# Altium schematic sheet Sheet1.SchDoc
size 420 x 297 mm; SheetNumber: 1; SheetTotal: 1
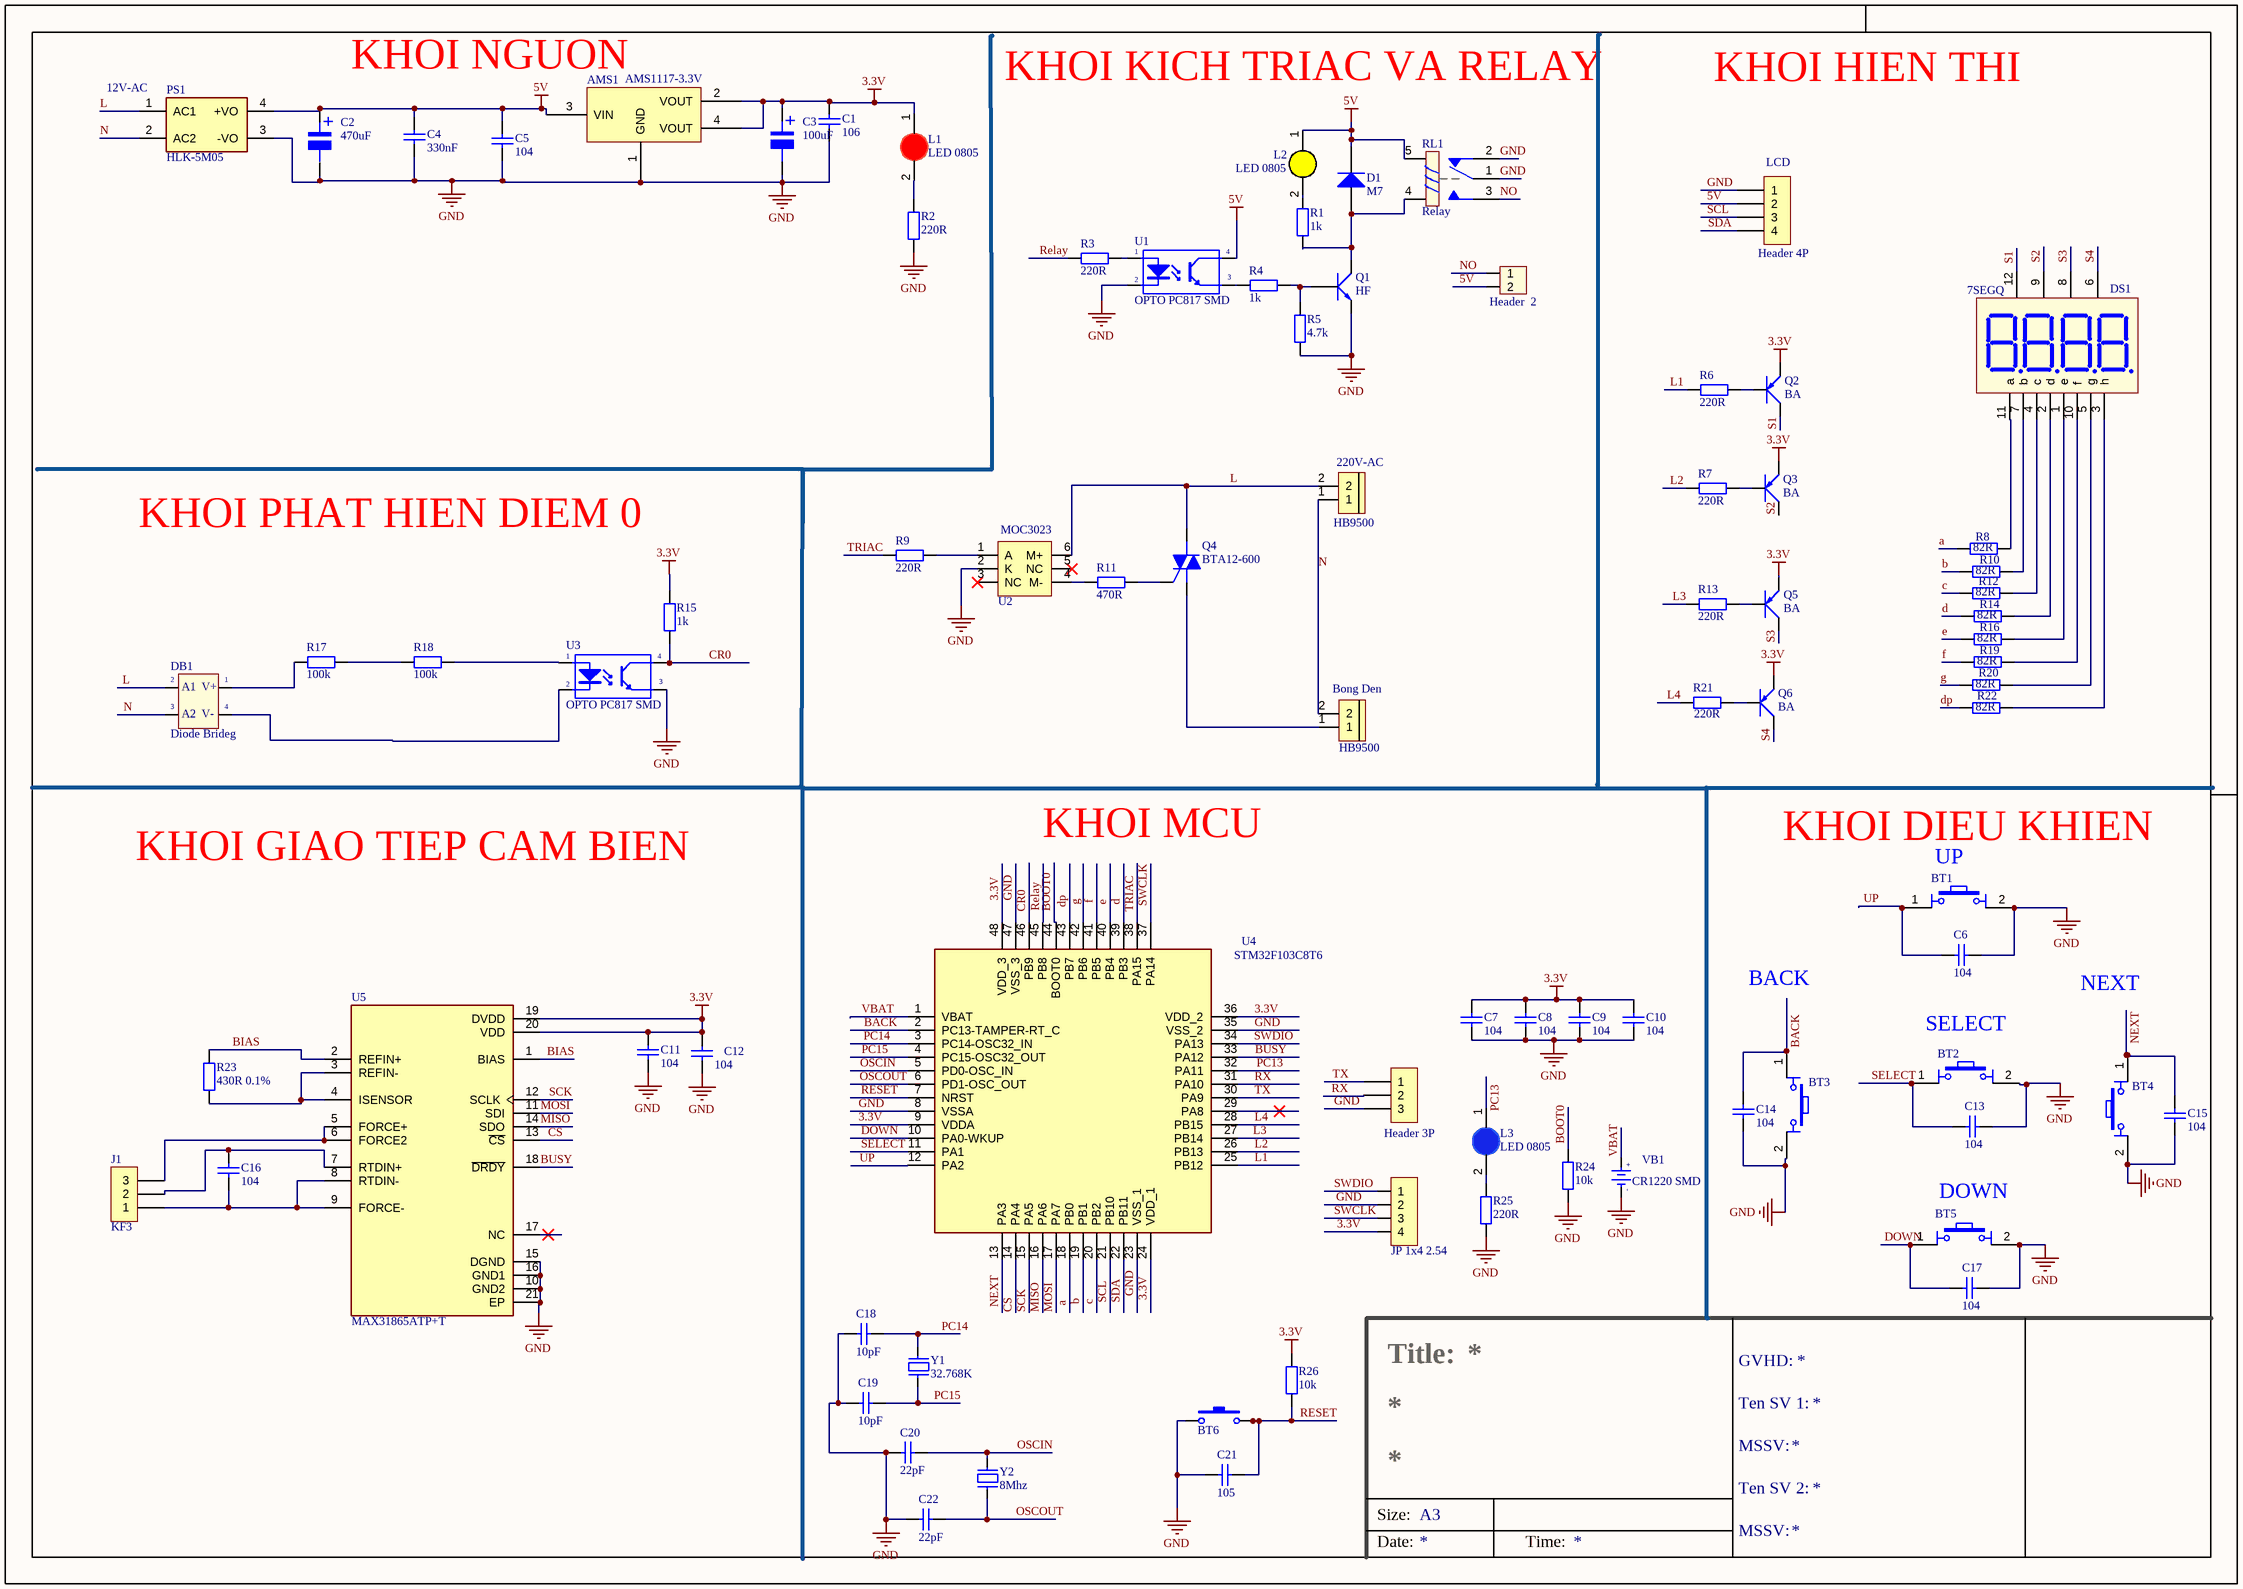
[diagram p0: Sheet1.SchDoc]

## Parts
220V-AC  HB9500  [CON 2 HB9500]
AMS1  AMS1117-3.3V  [SOT223]
Bong_Den  HB9500  [CON 2 HB9500]
BT1  (no value)  [Nut Nhan 4 Chan Cam 6x6]
BT2  (no value)  [Nut Nhan 4 Chan Cam 6x6]
BT3  (no value)  [Nut Nhan 4 Chan Cam 6x6]
BT4  (no value)  [Nut Nhan 4 Chan Cam 6x6]
BT5  (no value)  [Nut Nhan 4 Chan Cam 6x6]
BT6  Nut Nhan 2 Chan SMD 3x6x2.5  [Nut Nhan 2 Chan SMD 3x6x2.5]  (value not drawn)
C1  106  [tu 0805]
C2  470uF  [tu nhom 8 (f)]
C3  100uF  [tu nhom 6.3 (d)]
C4  330nF  [tu 0805]
C5  104  [tu 0805]
C6  104  [tu 0805]
C7  104  [tu 0805]
C8  104  [tu 0805]
C9  104  [tu 0805]
C10  104  [tu 0805]
C11  104  [tu 0805]
C12  104  [tu 0805]
C13  104  [tu 0805]
C14  104  [tu 0805]
C15  104  [tu 0805]
C16  104  [tu 0805]
C17  104  [tu 0805]
C18  10pF  [tu 0805]
C19  10pF  [tu 0805]
C20  22pF  [tu 0805]
C21  105  [tu 0805]
C22  22pF  [tu 0805]
D1  M7  [DIODE SMA]
DB1  Diode Brideg  [DIO-Bri 2A]
DS1  7SEGQ  [LED7SEG-4-0.56]
H1  Header 4P  [XH2.54M-4]
H2  Header  2  [XH2.54M-2]
H3  Header 3P  [XH2.54M-3]
J1  KF3  [KF3-8.5]
JP1  JP 1x4 2.54  [JP 1x4 DT]
L1  LED 0805  [LED-0805-Red]
L2  LED 0805  [LED-0805-Yellow]
L3  LED 0805  [LED-1206-Blue]
PS1  HLK-5M05  [CONV_HLK-5M05]
Q1  HF  [SOT23]
Q2  BA  [SOT23]
Q3  BA  [SOT23]
Q4  BTA12-600  [TO220H1]
Q5  BA  [SOT23]
Q6  BA  [SOT23]
R1  1k  [tro smd 0805]
R2  220R  [tro smd 0805]
R3  220R  [tro smd 0805]
R4  1k  [tro smd 0805]
R5  4.7k  [tro smd 0805]
R6  220R  [tro smd 0805]
R7  220R  [tro smd 0805]
R8  82R  [Tro SMD 0805]
R9  220R  [tro smd 0805]
R10  82R  [Tro SMD 0805]
R11  470R  [tro smd 1206]
R12  82R  [Tro SMD 0805]
R13  220R  [tro smd 0805]
R14  82R  [Tro SMD 0805]
R15  1k  [tro smd 0805]
R16  82R  [Tro SMD 0805]
R17  100k  [tro smd 2010]
R18  100k  [tro smd 2010]
R19  82R  [Tro SMD 0805]
R20  82R  [Tro SMD 0805]
R21  220R  [tro smd 0805]
R22  82R  [Tro SMD 0805]
R23  430R 0.1%  [Tro SMD 0805]
R24  10k  [tro smd 0805]
R25  220R  [tro smd 0805]
R26  10k  [tro smd 0805]
RL1  Relay  [Relay 5 Chan SRD]
U1  OPTO PC817 SMD  [SOP4]
U2  MOC3021M  [SO6]  (value not drawn)
U3  OPTO PC817 SMD  [SOP4]
U4  STM32F103C8T6  [LQFP-48_19.6_393_58X11_SMD]
U5  MAX31865ATP+T  [QFN65P500X500X80-21N]
VB1  CR1220 SMD  [DE PIN CR1220]
Y1  32.768K  [Thach Anh 2 Chan 32,768 KHz]
Y2  8Mhz  [Thach Anh 2 chan cam]

## Nets
3.3V: AMS1.2(VOUT) AMS1.4(VOUT) C1.1 C3.1 C7.1 C8.1 C9.1 C10.1 C11.1 C12.1 JP1.4 L1.1(A) Q2.2(E) Q3.2(E) Q5.2(E) Q6.2(E) R15.2 R26.2 U4.9(VDDA) U4.24(VDD_1) U4.36(VDD_2) U4.48(VDD_3) U5.19(DVDD) U5.20(VDD)
5V: AMS1.3(VIN) C2.1 C4.2 C5.1 D1.2(K) H1.2 H2.2 L2.1(A) PS1.4(+VO) RL1.5 U1.4(C)
GND: AMS1.1(GND) BT1.2 BT2.2 BT3.2 BT4.2 BT5.2 BT6.1 C1.2 C2.2 C3.2 C4.1 C5.2 C6.1 C7.2 C8.2 C9.2 C10.2 C11.2 C12.2 C13.1 C14.1 C15.1 C17.1 C18.2 C19.2 C20.2 C21.2 C22.2 H1.1 H3.3 JP1.2 PS1.3(-VO) Q1.2(E) R2.1 R5.1 R24.2 R25.1 RL1.1 RL1.2 U1.2(K) U2.2(K) U3.3(E) U4.8(VSSA) U4.23(VSS_1) U4.35(VSS_2) U4.47(VSS_3) U5.10(GND2) U5.15(DGND) U5.16(GND1) U5.21(EP) VB1.2(GND)
a: R8.1 U4.18(PB0)
b: R10.1 U4.19(PB1)
BACK: BT3.1 C14.2 U4.2(PC13-TAMPER-RT_C)
BIAS: R23.2 U5.1(BIAS) U5.2(REFIN+)
BOOT0: R24.1 U4.44(BOOT0)
BUSY: U4.33(PA12) U5.18(~{DRDY})
c: R12.1 U4.20(PB2)
CR0: R15.1 U3.4(C) U4.46(PB9)
CS: U4.14(PA4) U5.13(~{CS})
d: R14.1 U4.39(PB3)
DOWN: BT5.1 C17.2 U4.10(PA0-WKUP)
dp: R22.1 U4.43(PB7)
e: R16.1 U4.40(PB4)
f: R19.1 U4.41(PB5)
g: R20.1 U4.42(PB6)
L: 220V-AC.2 DB1.2(AC1) PS1.1(AC1) Q4.2(M2) U2.6(M+)
L1: R6.1 U4.25(PB12)
L2: R7.1 U4.26(PB13)
L3: R13.1 U4.27(PB14)
L4: R21.1 U4.28(PB15)
MISO: U4.16(PA6) U5.14(SDO)
MOSI: U4.17(PA7) U5.11(SDI)
N: 220V-AC.1 Bong_Den.2 DB1.3(AC2) PS1.2(AC2)
NEXT: BT4.1 C15.2 U4.13(PA3)
NO: H2.1 RL1.3
OSCIN: C20.1 U4.5(PD0-OSC_IN) Y2.2
OSCOUT: C22.1 U4.6(PD1-OSC_OUT) Y2.1
PC13: L3.1(A) U4.32(PA11)
PC14: C18.1 U4.3(PC14-OSC32_IN) Y1.2
PC15: C19.1 U4.4(PC15-OSC32_OUT) Y1.1
Relay: R3.1 U4.45(PB8)
RESET: BT6.2 C21.1 R26.1 U4.7(NRST)
RX: H3.2 U4.31(PA10)
S1: DS1.12(V1) Q2.3(C)
S2: DS1.9(V2) Q3.3(C)
S3: DS1.8(V3) Q5.3(C)
S4: DS1.6(V4) Q6.3(C)
SCK: U4.15(PA5) U5.12(SCLK)
SCL: H1.3 U4.21(PB10)
SDA: H1.4 U4.22(PB11)
SELECT: BT2.1 C13.2 U4.11(PA1)
SWCLK: JP1.3 U4.37(PA14)
SWDIO: JP1.1 U4.34(PA13)
TRIAC: R9.1 U4.38(PA15)
TX: H3.1 U4.30(PA9)
UP: BT1.1 C6.2 U4.12(PA2)
VBAT: U4.1(VBAT) VB1.1(+3V)
NetBong_Den_1: Bong_Den.1 Q4.1(M1)
NetC16_1: C16.1 J1.2 U5.7(RTDIN+)
NetC16_2: C16.2 J1.1 U5.8(RTDIN-) U5.9(FORCE-)
NetD1_1: D1.1(A) Q1.3(C) R1.2 RL1.4
NetDB1_1: DB1.1(+V_OUT) R17.1
NetDB1_4: DB1.4(-V_OUT) U3.2(K)
NetDS1_1: DS1.1(e) R16.2
NetDS1_2: DS1.2(d) R14.2
NetDS1_3: DS1.3(h) R22.2
NetDS1_4: DS1.4(c) R12.2
NetDS1_5: DS1.5(g) R20.2
NetDS1_7: DS1.7(b) R10.2
NetDS1_10: DS1.10(f) R19.2
NetDS1_11: DS1.11(a) R8.2
NetJ1_3: J1.3 U5.5(FORCE+) U5.6(FORCE2)
NetL1_2: L1.2(K) R2.2
NetL2_2: L2.2(K) R1.1
NetL3_2: L3.2(K) R25.2
NetQ1_1: Q1.1(B) R4.1 R5.2
NetQ2_1: Q2.1(B) R6.2
NetQ3_1: Q3.1(B) R7.2
NetQ4_3: Q4.3(G) R11.2
NetQ5_1: Q5.1(B) R13.2
NetQ6_1: Q6.1(B) R21.2
NetR3_2: R3.2 U1.1(A)
NetR4_2: R4.2 U1.3(E)
NetR9_2: R9.2 U2.1(A)
NetR11_1: R11.1 U2.4(M-)
NetR17_2: R17.2 R18.1
NetR18_2: R18.2 U3.1(A)
NetR23_1: R23.1 U5.3(REFIN-) U5.4(ISENSOR)

Not connected (* = marked no-connect by the designer): U2 3(NC)* 5(NC)*; U4 29(PA8)*; U5 17(NC)*

## Notes on the sheet
- (near PS1) 12V-AC
- (near AMS1) KHOI NGUON
- KHOI KICH TRIAC VA RELAY
- KHOI HIEN THI
- (near H1) LCD
- KHOI PHAT HIEN DIEM 0
- (near U2) MOC3023
- KHOI GIAO TIEP CAM BIEN
- KHOI MCU
- KHOI DIEU KHIEN
- (near BT1) UP
- BACK
- NEXT
- SELECT
- DOWN
- Title:
- Ten SV 1:
- GVHD:
- MSSV:
- Size:
- A3
- Ten SV 2:
- Date:
- Time:
- (in symbol De pin CR1220 SMD) +; -
- (in symbol DIODE BRIGDE) A1; V+; A2; V-
- (in symbol Tu Nhom 100uF 16V) +
- (in symbol Tu Nhom 470uF 16V) +

## Library data of the parts
220V-AC Bong_Den = CON 2 HB9500: Cắm; Ma_Hang: MH002054; Ten_Linh_Kien: CON 2 HB9500-2P 9.5MM; Don_Vi: Con; Chung_Loai: Cắm; Ghi_Chu: *; Kieu_Chan: *
AMS1 = AMS1117 SMD: Dán; Value: AMS1117-3.3V SOT223; Don_Vi: Con; Ma_Hang: MH000596; Ghi_Chu: *; Kieu_Chan: *; Chung_Loai: Dán
BT1-BT5 = Nut Nhan 4 Chan Cam 6x6: Nut Nhan 4 Chan 6x6mm; Ten: Nút Nhấn 4 Chân 6x6x5MM DIP; Ma_Hang: MH004584
BT6 = Nut Nhan 2 Chan SMD 3x6x2.5: Ma_Hang: MH001036; Ten: Nút Nhấn 2 Chân 3x6x2.5MM SMD
C1 C11 C12 C16 = Tu 0805 106 16V 10%: Dán; Ten_Linh_Kien: Tụ 0805 106-10uF 10% 16V; So_Chan: 2; Don_Vi: Con; Ma_Hang: MH004553; Chung_Loai: Dán; Kieu_Chan: *
C2 = Tu Nhom 470uF 16V: Dán; Don_Vi: Con; So_Chan: 2; Ten_Linh_Kien: Tụ Nhôm 470uF 16V 8x10.4MM; Ma_Hang: MH001940; Chung_Loai: Dán; Kieu_Chan: *
C3 = Tu Nhom 100uF 16V: Dán; Don_Vi: Con; So_Chan: 2; Ten_Linh_Kien: Tụ Nhôm 100uF 16V 6.3x5.4MM; Ma_Hang: MH002219; Chung_Loai: Dán; Kieu_Chan: *
C4 = Tu 0805 332 50V 10%: Dán; Don_Vi: Con; So_Chan: 2; Ten_Linh_Kien: Tụ 0805 332-3.3nF 10% 50V; Ma_Hang: MH004561; Chung_Loai: Dán; Kieu_Chan: *
C5-C10 C13-C15 C17 = Tu 0805 104 50V 10%: Dán; Don_Vi: Con; So_Chan: 2; Ten_Linh_Kien: Tụ 0805 104-100nF 10% 50V; Ma_Hang: MH004551; Chung_Loai: Dán; Kieu_Chan: *
C18 C19 = Tu 0805 10pF 50V 10%: Dán; Don_Vi: Con; Ten_Linh_Kien: Tụ 0805 10P 10% 50V; So_Chan: 2; Ma_Hang: MH004554; Chung_Loai: Dán; Kieu_Chan: *
C20 C22 = Tu 0805 22pF 50V 10%: Dán; Don_Vi: Con; Ten_Linh_Kien: Tụ 0805 22P 10% 50V; So_Chan: 2; Ma_Hang: MH004560; Chung_Loai: Dán; Kieu_Chan: *
C21 = Tu 0805 105 50V 10%: Dán; Don_Vi: Con; So_Chan: 2; Ten_Linh_Kien: Tụ 0805 105-1uF 10% 50V; Ma_Hang: MH004552; Chung_Loai: Dán; Kieu_Chan: *
D1 = Diode M7 ( 4007 ): Dán; Don_Vi: Con; Ten_Linh_Kien: Diode M7 1N4007 SMD 1A 1000V; Ma_Hang: MH000944; Chung_Loai: Dán; Ghi_Chu: *
DB1 = DIODE BRIGDE: Convert AC to DC voltage, 4 pin; Value: Cau 1A
DS1 = LED7SEG-4: Four 7 Seg Dipslay; Value: LED 7Q SEG
H1 = Header 4P 2.54 Duc Thang: Cắm; Ten_Linh_Kien: Header 4P XH2.54-4P Đực Thẳng; Don_Vi: Con; Ma_Hang: MH001285; Chung_Loai: Cắm
H2 = Header 2P 2.54 Duc Thang: Cắm; Ten_Linh_Kien: Header 2P XH2.54-2P Đực Thẳng; Don_Vi: Con; Ma_Hang: MH001283; Chung_Loai: Cắm
H3 = Header 3P 2.54 Duc Thang: Cắm; Ten_Linh_Kien: Header 3P XH2.54-3P Đực Thẳng; Don_Vi: Con; Ma_Hang: MH001292; Chung_Loai: Cắm
J1 = KF3: Manufacturer: Würth Elektronik eiSos GmbH; partNo: 691103110003; ComponentLink1 Description: Manufacturer; ComponentLink2 Description: Datasheet; NoPins: 3; Created Date: 29 October 2013; ComponentLink1URL: http://www.we-online.com; ComponentLink2URL: http://katalog.we-online.de/em/datasheet/6911031100xx.pdf; Created by: Karrer Zheng
JP1 = JP 1x4 2.54 Duc Thang: Cắm; Ten_Linh_Kien: Jump Đơn Đực 2.54MM 1x40P Thẳng 11MM; Don_Vi: Con; Ma_Hang: MH000903; Ghi_Chu: *; Kieu_Chan: *; Chung_Loai: Cắm
L1 = LED 0805 Do: Dán; Don_Vi: Con; Ma_Hang: MH000897; Ten_Linh_Kien: LED 0805 Màu Đỏ (Red); Ghi_Chu: *; Kieu_Chan: *; Chung_Loai: Dán
L2 = LED 0805 Vang: Dán; Don_Vi: Con; Ma_Hang: MH002329; Ten_Linh_Kien: LED 0805 Màu Vàng ( Yellow); Ghi_Chu: *; Kieu_Chan: *; Chung_Loai: Dán
L3 = LED 1206 Xanh Duong: Dán; Don_Vi: Con; Ma_Hang: MH002333; Ten_Linh_Kien: LED1206 Màu Xanh Dương (Blue); Ghi_Chu: *; Kieu_Chan: *; Chung_Loai: Dán
PS1 = HLK-5M05: AC DC 220V to 5V 5W 5Watt Isolated Switching Step-Down Power Supply Module Converter; MF: Hi-link; Check_prices: https://www.snapeda.com/parts/HLK-5M05/Hi-link/view-part/?ref=eda; SnapEDA_Link: https://www.snapeda.com/parts/HLK-5M05/Hi-link/view-part/?ref=snap; Price: None; Availability: Not in stock; Package: Package; MP: HLK-5M05; Value: *
Q1 = C1815 HF SMD: NPN transistor; Value: C9014
Q2 Q3 Q5 Q6 = A1015 BA SMD: PNP 600mW, ECB
Q4 = BTA12-600: Silicon Bidirectional Triode Thyristor; Note: Pin 2 is electrically connected to Pin 4 (TAB); Published: 29-Sep-2000; LatestRevisionDate: 17-Jul-2002; LatestRevisionNote: Re-released for DXP Platform.; DatasheetDocument: 1999; PackageReference: 369-03; Publisher: Altium Limited; Code_JEDEC: TO-251-AA; ComponentLink1Description: Manufacturer Link; ComponentLink1URL: http://www.motorola.com/
R1 R4 R15 = Tro 0805 5% 1k: Dán; Don_Vi: Con; So_Chan: 2; Ten_Linh_Kien: Trở 0805 5% 1k; Ma_Hang: MH005234; Chung_Loai: Dán; Kieu_Chan: *
R2 = Tro 0805 5% 100R: Dán; Don_Vi: Con; So_Chan: 2; Ten_Linh_Kien: Trở 0805 5% 100R; Ma_Hang: MH005251; Chung_Loai: Dán; Kieu_Chan: *
R3 R25 = Tro 0805 5% 220R: Dán; Don_Vi: Con; So_Chan: 2; Ten_Linh_Kien: Trở 0805 5% 220R; Ma_Hang: MH005259; Chung_Loai: Dán; Kieu_Chan: *
R5 = Tro 0805 5% 4.7k: Dán; Don_Vi: Con; So_Chan: 2; Ten_Linh_Kien: Trở 0805 5% 4.7k; Ma_Hang: MH005307; Chung_Loai: Dán; Kieu_Chan: *
R6 R7 R9 R13 R21 = Tro 0805 5% 150R: Dán; Don_Vi: Con; So_Chan: 2; Ten_Linh_Kien: Trở 0805 5% 150R; Ma_Hang: MH005255; Chung_Loai: Dán; Kieu_Chan: *
R8 R10 R12 R14 R16 R19 R20 R22 = Tro 0805 5% 75R: Dán; Don_Vi: Con; So_Chan: 2; Ten_Linh_Kien: Trở 0805 5% 75R; Ma_Hang: MH005328; Chung_Loai: Dán; Kieu_Chan: *
R11 = Tro 1206 5% 680R: Dán; Don_Vi: Con; So_Chan: 2; Ten_Linh_Kien: Trở 1206 5% 680R; Ma_Hang: MH005928; Chung_Loai: Dán; Kieu_Chan: *
R17 R18 = Tro 2010 5% 10k: Dán; Don_Vi: Con; So_Chan: 2; Ten_Linh_Kien: Trở 2010 5% 103-10k; Ma_Hang: MH005617; Chung_Loai: Dán; Kieu_Chan: *
R23 = Tro 0805 5% 470R: Dán; Don_Vi: Con; Ma_Hang: MH005341; Ten_Linh_Kien: Trở 0805 5% 470R; So_Chan: 2; Chung_Loai: Dán; Kieu_Chan: *
R24 R26 = Tro 0805 5% 10k: Dán; Don_Vi: Con; So_Chan: 2; Ten_Linh_Kien: Trở 0805 5% 10k; Ma_Hang: MH005239; Chung_Loai: Dán; Kieu_Chan: *
RL1 = Relay 5 Chan SRD: Relay 5 Chan; Ma_Hang: MH009374; Ten: Relay 5V10A SRD-05VDC-SL-C Chính Hãng
U1 U3 = OPTO PC817 SMD: Single Opto; Value: PC817
U4 = IC_STM32F103C8T6: ARM® Cortex®-M3 STM32F1 Microcontroller IC 32-Bit 72MHz 64KB (64K x 8) FLASH 48-LQFP (7x7) /; Manufacturer: STMicroelectronics; Alternate Part Number-1: NA; Manufacturer Part Number: STM32F103C8T6; Case/Package: LQFP48; Supplier-1: LCSC; Supplier Part Number-1: STM32F103C8T6
U5 = MAX31865ATP+T: RTD-to-Digital Converter; MF: Analog Devices; SnapEDA_Link: https://www.snapeda.com/parts/MAX31865ATP+T/Analog+Devices/view-part/?ref=snap; Package: QFN-20 Maxim; Value: *; MP: MAX31865ATP+T; Check_prices: https://www.snapeda.com/parts/MAX31865ATP+T/Analog+Devices/view-part/?ref=eda
VB1 = De pin CR1220 SMD: Ten: Đế PIN CR1220 SMD; Ma_Hang: MH000833
Y1 = Thach Anh 2 chan 32,768 Khz: Crystal For all Crystal 2pin.; Value: 4Mhz
Y2 = Thach Anh 2 chan Cam: Crystal For all Crystal 2pin.; Value: 4Mhz